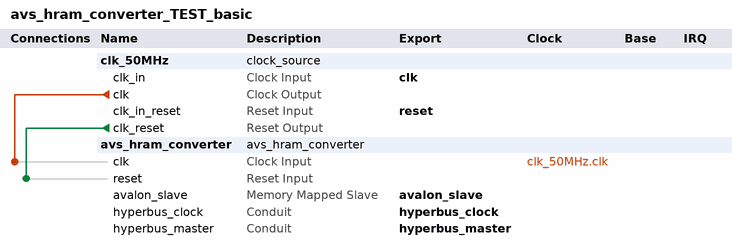
[diagram p0: system contents]
# Platform Designer (Qsys) system avs_hram_converter_TEST_basic, Cyclone 10 LP 10CL006YE144A7G
# Parameters at their usual value, and those the tool derives, are not listed.
package require -exact qsys 22.1
create_system avs_hram_converter_TEST_basic
set_project_property DEVICE_FAMILY {Cyclone 10 LP}
set_project_property DEVICE 10CL006YE144A7G

add_instance clk_50MHz clock_source 22.1
set_instance_parameter_value clk_50MHz clockFrequency 50000000

add_instance avs_hram_converter avs_hram_converter 1.0

# connections
add_connection clk_50MHz.clk avs_hram_converter.clk clock
add_connection clk_50MHz.clk_reset avs_hram_converter.reset reset

# exported interfaces
add_interface avalon_slave avalon slave
set_interface_property avalon_slave EXPORT_OF avs_hram_converter.avalon_slave
add_interface clk clock sink
set_interface_property clk EXPORT_OF clk_50MHz.clk_in
add_interface hyperbus_clock conduit end
set_interface_property hyperbus_clock EXPORT_OF avs_hram_converter.hyperbus_clock
add_interface hyperbus_master conduit end
set_interface_property hyperbus_master EXPORT_OF avs_hram_converter.hyperbus_master
add_interface reset reset sink
set_interface_property reset EXPORT_OF clk_50MHz.clk_in_reset

set_interconnect_requirement {$system} qsys_mm.clockCrossingAdapter HANDSHAKE
set_interconnect_requirement {$system} qsys_mm.enableEccProtection FALSE
set_interconnect_requirement {$system} qsys_mm.insertDefaultSlave FALSE
set_interconnect_requirement {$system} qsys_mm.maxAdditionalLatency 1

save_system avs_hram_converter_TEST_basic.qsys
